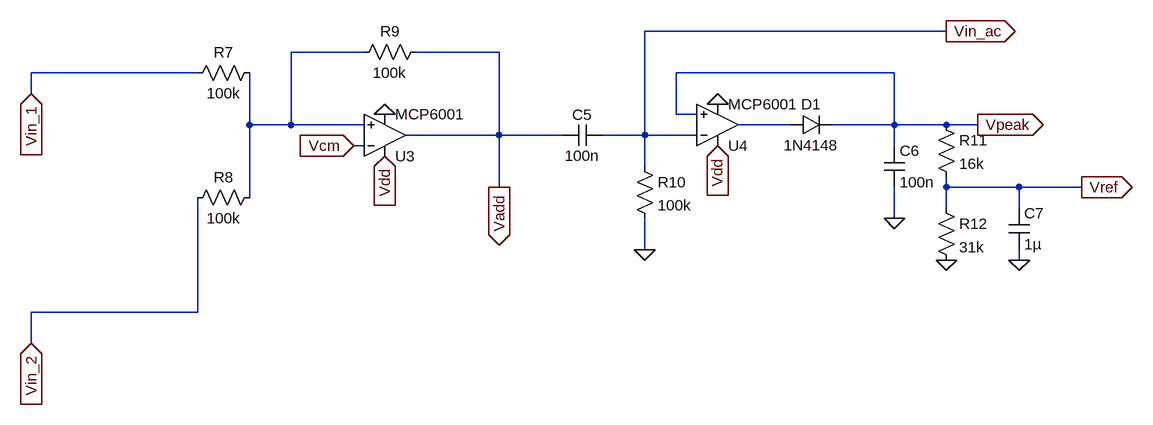
[diagram p0: schematic Draft22.asc]
Draft22.asc, the LTspice schematic file:
Version 4
SHEET 1 1144 680
WIRE 880 0 416 0
WIRE -16 32 -128 32
WIRE 192 32 64 32
WIRE -272 64 -528 64
WIRE 800 64 464 64
WIRE -528 96 -528 64
WIRE 464 128 464 64
WIRE 496 128 464 128
WIRE -192 144 -192 64
WIRE -128 144 -128 32
WIRE -128 144 -192 144
WIRE -16 144 -128 144
WIRE 640 144 560 144
WIRE 800 144 800 64
WIRE 800 144 704 144
WIRE 880 144 800 144
WIRE 928 144 880 144
WIRE 192 160 192 32
WIRE 192 160 48 160
WIRE 288 160 192 160
WIRE 416 160 416 0
WIRE 416 160 352 160
WIRE 496 160 416 160
WIRE -16 176 -32 176
WIRE 800 176 800 144
WIRE 416 208 416 160
WIRE 192 240 192 160
WIRE 880 240 880 224
WIRE 992 240 880 240
WIRE 1088 240 992 240
WIRE -192 256 -192 144
WIRE 880 272 880 240
WIRE 992 272 992 240
WIRE 800 288 800 240
WIRE 416 336 416 288
WIRE 992 352 992 336
WIRE -272 432 -272 256
WIRE -272 432 -528 432
WIRE -528 480 -528 432
FLAG 416 336 0
FLAG -32 176 Vcm
IOPIN -32 176 In
FLAG 528 112 0
FLAG 528 176 Vdd
IOPIN 528 176 In
FLAG 16 128 0
FLAG 16 192 Vdd
IOPIN 16 192 In
FLAG 800 288 0
FLAG 880 352 0
FLAG 992 352 0
FLAG 1088 240 Vref
IOPIN 1088 240 Out
FLAG 192 240 Vadd
IOPIN 192 240 Out
FLAG -528 96 Vin_1
IOPIN -528 96 In
FLAG -528 480 Vin_2
IOPIN -528 480 In
FLAG 928 144 Vpeak
IOPIN 928 144 Out
FLAG 880 0 Vin_ac
IOPIN 880 0 Out
SYMBOL MCP6001 16 160 M180
SYMATTR InstName U3
SYMBOL res -176 48 R90
WINDOW 0 0 56 VBottom 2
WINDOW 3 32 56 VTop 2
SYMATTR InstName R7
SYMATTR Value 100k
SYMBOL res -176 240 R90
WINDOW 0 0 56 VBottom 2
WINDOW 3 32 56 VTop 2
SYMATTR InstName R8
SYMATTR Value 100k
SYMBOL res 80 16 R90
WINDOW 0 0 56 VBottom 2
WINDOW 3 32 56 VTop 2
SYMATTR InstName R9
SYMATTR Value 100k
SYMBOL cap 352 144 R90
WINDOW 0 0 32 VBottom 2
WINDOW 3 32 32 VTop 2
SYMATTR InstName C5
SYMATTR Value 100n
SYMBOL MCP6001 528 144 M180
SYMATTR InstName U4
SYMBOL res 400 192 R0
SYMATTR InstName R10
SYMATTR Value 100k
SYMBOL diode 640 160 R270
WINDOW 0 32 32 VTop 2
WINDOW 3 0 32 VBottom 2
SYMATTR InstName D1
SYMATTR Value 1N4148
SYMBOL cap 784 176 R0
SYMATTR InstName C6
SYMATTR Value 100n
SYMBOL res 864 128 R0
SYMATTR InstName R11
SYMATTR Value 16k
SYMBOL res 864 256 R0
SYMATTR InstName R12
SYMATTR Value 31k
SYMBOL cap 976 272 R0
SYMATTR InstName C7
SYMATTR Value 1µ

The netlist it stands for:
* Draft22.asc
* U3: MCP6001 (symbol MCP6001 not available, pins judged from their places): In+=N001 In-=Vcm V+=Vdd V-=0 OUT=Vadd
R7 N001 Vin_1 100k
R8 N001 Vin_2 100k
R9 Vadd N001 100k
C5 Vin_ac Vadd 100n
* U4: MCP6001 (symbol MCP6001 not available, pins judged from their places): In+=Vpeak In-=Vin_ac V+=Vdd V-=0 OUT=N002
R10 Vin_ac 0 100k
D1 N002 Vpeak 1N4148
C6 Vpeak 0 100n
R11 Vpeak Vref 16k
R12 Vref 0 31k
C7 Vref 0 1µ
.model D D
.lib standard.dio
.backanno
.end